# EAGLE design Main (EAGLE 7.6.0)
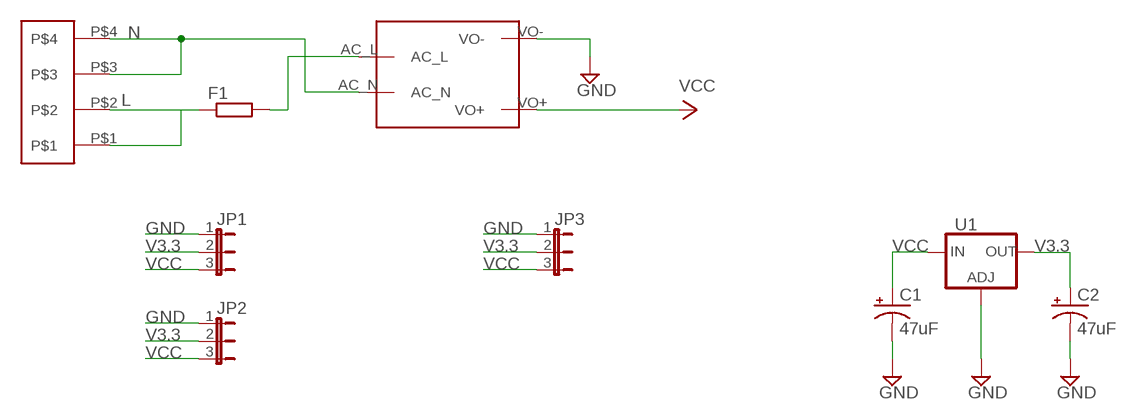
[diagram p0: schematic, sheet 1]

## Parts
17928891  1792889  [1792889]
C1  47uF  CAP_POL3528  [EIA3528]
C2  47uF  CAP_POL3528  [EIA3528]
F1  R-EU_R2010W  [R2010W]
JP1  JP2E  [JP2]
JP2  JP2E  [JP2]
JP3  JP2E  [JP2]
PWR1  MAINS_CONVERTERS  [HLK-PM01]
U1  V_REG_3.3V  V_REG_317SMD  [SOT223]

## Nets
GND [PWR]: C1.C(-) C2.C(-) JP1.1 JP2.1 JP3.1 PWR1.VO- U1.1(ADJ)
L: 17928891.P$1 17928891.P$2 F1.1
N [230V]: 17928891.P$3 17928891.P$4 PWR1.AC_N
N$1: F1.2 PWR1.AC_L
V3.3 [PWR]: C2.A(+) JP1.2 JP2.2 JP3.2 U1.2(OUT)
VCC [PWR]: C1.A(+) JP1.3 JP2.3 JP3.3 PWR1.VO+ U1.3(IN)

## Library data of the parts
17928891 = library:1792889
C1 C2 = SparkFun-Capacitors:CAP_POL: Capacitor Polarized These are standard SMD and PTH capacitors. Normally 10uF, 47uF, and 100uF in electrolytic and tantalum varieties. Always verify the external diameter of the through hole cap, it varies with capacity, voltage, and manufacturer. The EIA devices should be standard.
F1 = resistor:R-EU_: RESISTOR, European symbol
JP1-JP3 = jumper:JP2E: JUMPER
PWR1 = captain-slow:MAINS_CONVERTERS
U1 = SparkFun-PowerIC:V_REG_317: Voltage Regulator Standard LM317 adjustable voltage regulator. AOI (Adjust Output Input). Google 'LM317 Calculator' for easy to use app to get the two resistor values needed. 240/720 for 5V output. 240/390 for 3.3V output. Spark Fun Electronics SKU : COM-00527

## Net classes
0 default: clearance 0.205 mm
1 230V: width 1.27 mm, clearance 0.205 mm to class 0, clearance 2.54 mm
2 PWR: width 0.635 mm, clearance 0.205 mm to class 0, clearance 0.205 mm to class 1, clearance 1.27 mm

## Board
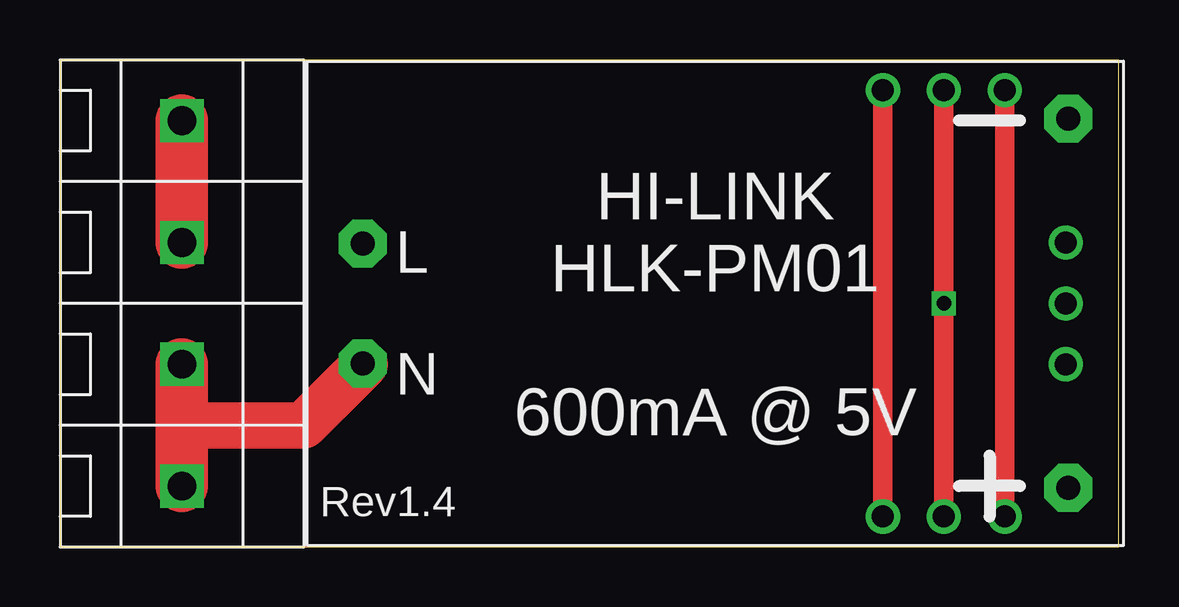
[diagram p1: board, top side]
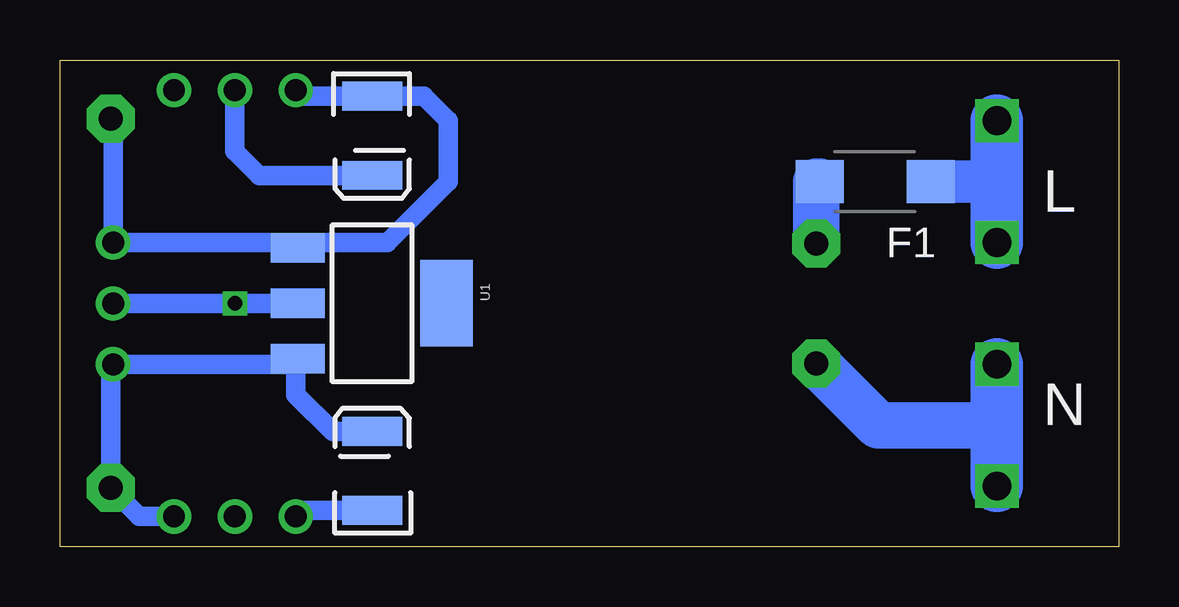
[diagram p2: board, bottom side, seen from below]

Size 44.12 x 20.31 mm. Coordinates in mm from the lower left corner, seen from the top.
Outline: 0,0 44.12,0 44.12,20.31 0,20.31 0,0
Copper layers (1*16): Top 0.035mm / dielectric 1.5mm / Bottom 0.035mm
Design rules "default": minimum track width 10mil, minimum drill 24mil, track to track 8mil, track to pad 8mil, pad to pad 8mil, via to via 8mil, smd to smd 8mil, copper to edge 40mil, drill to drill 8mil, minimum pad ring 10mil, minimum via ring 8mil, stop-mask expansion 4mil, vias tented up to drill 0mil, thermal gap 10mil

### Footprints (pad centres in the part's own frame; a part is rotated, then mirrored left to right if it is on the bottom)
1792889 = drill 1.2 square: P$1 -7.62,0; P$2 -2.54,0; P$3 2.54,0; P$4 7.62,0
EIA3528 = smd 1.2 x 2.5: A 1.65,0; C -1.65,0
R2010W = smd 2 x 1.8: 1 -2.311,0; 2 2.311,0
JP2 = drill 0.914: 1 -2.54,0; 2 0,0; 3 2.54,0
HLK-PM01 = drill 1 pad 2 octagon: AC_L -14.7,2.5; AC_N -14.7,-2.5; VO+ 14.7,-7.7; VO- 14.7,7.7
SOT223 = smd 1.219 x 2.235: 1 -2.311,-3.099; 2 0,-3.099; 3 2.311,-3.099 | smd 3.6 x 2.2: 4 0,3.099

### Placement (x,y rotation side)
17928891  5.08,10.16 270 top
C1  31.11,3.17 90 bottom
C2  31.11,17.14 270 bottom
F1  10.16,15.24 180 bottom
JP1  36.83,19.05 0 top
JP2  41.91,10.16 270 top
JP3  36.83,1.27 0 top
PWR1  27.3,10.16 0 top
U1  31.11,10.16 270 bottom

### Tracks (layer width: path | path; a pad name or v marks a point on that pad's centre or on a via)
GND
  Top 0.813: JP3.1 JP1.1
  Bottom 0.813: C1.C 34.03,1.52 JP3.1 | JP1.1 34.03,18.8 C2.C 28.95,18.8 27.94,17.78 27.94,15.24 30.48,12.7 34.44,12.7 | PWR1.VO- 41.91,17.77 JP2.1 34.44,12.7 | 34.44,12.7 U1.1
L
  Top 2.184: 17928891.P$1 17928891.P$2
  Bottom 1.778: F1.1 5.08,15.24
  Bottom 2.184: 17928891.P$2 17928891.P$1
N
  Top 1.93: 12.7,7.62 10.16,5.08 5.08,5.08 17928891.P$3
  Top 2.184: 17928891.P$3 17928891.P$4
  Bottom 1.93: PWR1.AC_N 10.03,5.08 5.08,5.08
  Bottom 2.184: 17928891.P$4 5.08,5.08 17928891.P$3
N$1
  Bottom 1.93: F1.2 12.61,15.24 PWR1.AC_L
V3.3  (via drill 0.6)
  Top 0.813: JP3.2 v36.83,10.16 JP1.2
  Bottom 0.813: JP2.2 v36.83,10.16 U1.2 | JP1.2 36.83,16.51 35.81,15.49 C2.A
VCC
  Top 0.813: JP3.3 JP1.3
  Bottom 0.813: C1.A 32.77,4.83 34.29,6.35 34.29,7.77 U1.3 34.44,7.62 JP2.3 42.01,7.53 PWR1.VO+ 40.81,1.27 JP3.3

### Text on the board
tNames: L | N | Rev1.4
bNames: L | N